# EAGLE schematic TripleCtrl (EAGLE 7.6.0)
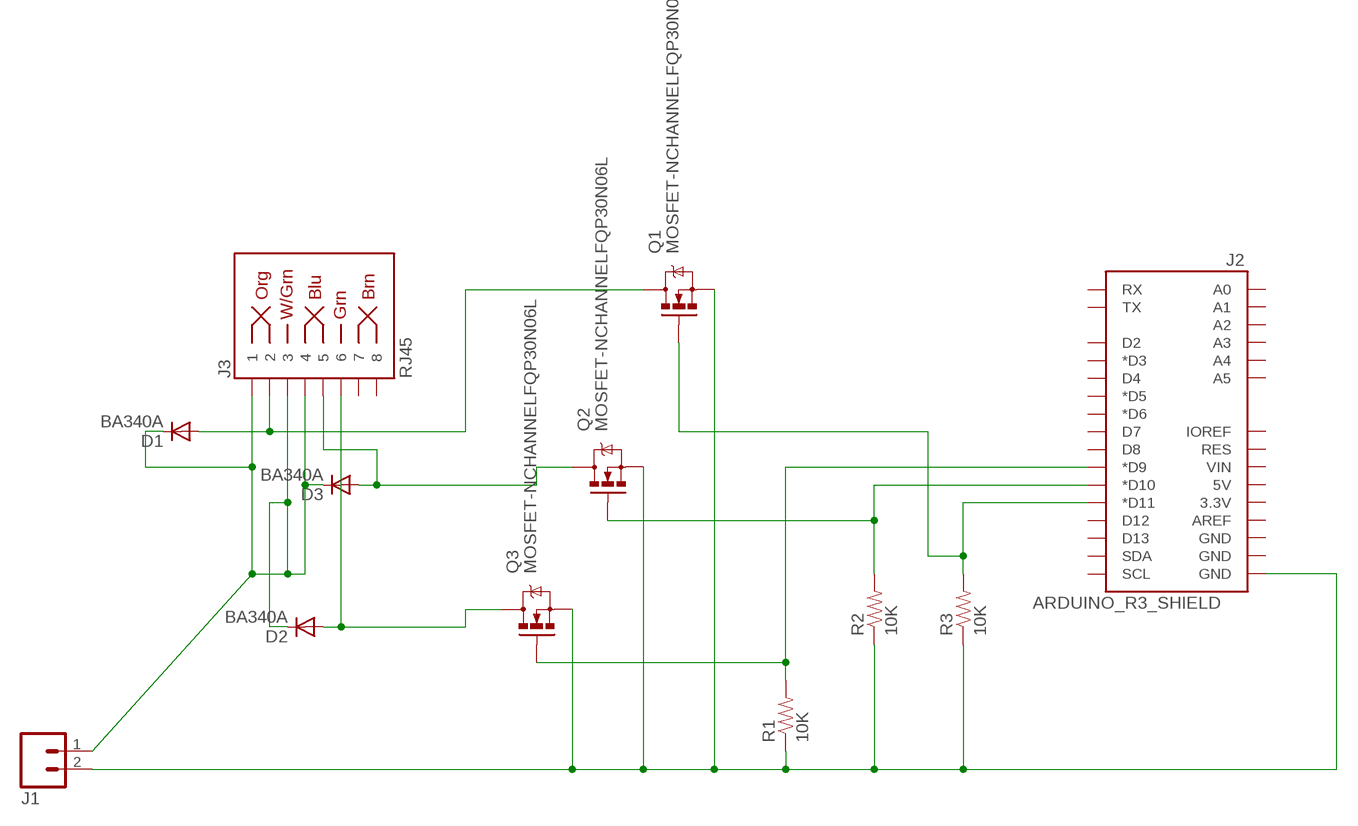
[diagram p0: schematic, sheet 1]

## Parts
D1  BA340A  1N4004  [DO41-10]
D2  BA340A  1N4004  [DO41-10]
D3  BA340A  1N4004  [DO41-10]
J1  M025MM  [SCREWTERMINAL-5MM-2]
J2  ARDUINO_R3_SHIELD  [UNO_R3_SHIELD]
J3  RJ45  RJ45-8PTH  [RJ45-8]
Q1  MOSFET-NCHANNELFQP30N06L  [TO220V]
Q2  MOSFET-NCHANNELFQP30N06L  [TO220V]
Q3  MOSFET-NCHANNELFQP30N06L  [TO220V]
R1  10K  10KOHM-1/6W-5%(PTH)KIT  [AXIAL-0.3-KIT]
R2  10K  10KOHM-1/6W-5%(PTH)KIT  [AXIAL-0.3-KIT]
R3  10K  10KOHM-1/6W-5%(PTH)KIT  [AXIAL-0.3-KIT]

## Nets
N$1: D1.C D2.C D3.C J1.1 J3.1 J3.3 J3.4
N$2: J1.2 J2.GND@0(GND) Q1.3(S) Q2.3(S) Q3.3(S) R1.P$1 R2.P$1 R3.P$1
N$3: D1.A J3.2 Q1.2(D)
N$4: J2.D11(*D11) Q1.1(G) R3.P$2
N$5: D2.A J3.6 Q3.2(D)
N$6: D3.A J3.5 Q2.2(D)
N$7: J2.D10(*D10) Q2.1(G) R2.P$2
N$8: J2.D9(*D9) Q3.1(G) R1.P$2
Unconnected: J2.3.3V J2.5V J2.A0 J2.A1 J2.A2 J2.A3 J2.A4 J2.A5 J2.AREF J2.D2 J2.D3(*D3) J2.D4 J2.D5(*D5) J2.D6(*D6) J2.D7 J2.D8 J2.D12 J2.D13 J2.GND@1(GND) J2.GND@2(GND) J2.IOREF J2.RES J2.RX J2.SCL J2.SDA J2.TX J2.VIN J3.7 J3.8

## Library data of the parts
D1-D3 = diode:1N4004: DIODE general purpose rectifier, 1 A
J1 = SparkFun-Connectors:M02: Standard 2-pin 0.1" header. Use with - straight break away headers ( PRT-00116) - right angle break away headers (PRT-00553) - swiss pins (PRT-00743) - machine pins (PRT-00117) - female headers (PRT-00115) Molex polarized connector foot print use with: PRT-08233 with associated crimp pins and housings. 2.54_SCREWTERM for use with PRT-10571. 3.5mm Screw Terminal footprints for PRT-08084 5mm Screw Terminal footprints for use with PRT-08432; STOREFRONT_ID: PRT-08432
J2 = SparkFun-Boards:ARDUINO_R3_SHIELD: Shield form compatible with the Arduino Uno R3.
J3 = SparkFun-Connectors:RJ45-8: RJ45 Jack Simple RJ45, 8-pin connection - connector for common Cat5, Cat5e, and Cat6 Ethernet cables. Footprint not yet proven in production. Connector sku is PRT-00643; Breakout PCB sku is BOB-00716.; PROD_ID: CONN-08506
Q1-Q3 = SparkFun-DiscreteSemi:MOSFET-NCHANNEL: Common NMOSFET Parts MFG P/N Store ID Prod ID FDD8780 TRANS-09984 SI7820DN TRANS-11055 FDS6630A IC-08089 2N7002PW TRANS-11151 FQP30N06L COM-10213 TRANS-10060 BSS123LT1G TRANS-08345 BSS138 TRANS-00830 BS170 2N7000; PROD_ID: TRANS-10060
R1-R3 = SparkFun-Resistors:10KOHM-1/6W-5%(PTH): RES-08375; PROD_ID: RES-08375